# EAGLE design wfipic32 (EAGLE 9.6.2)
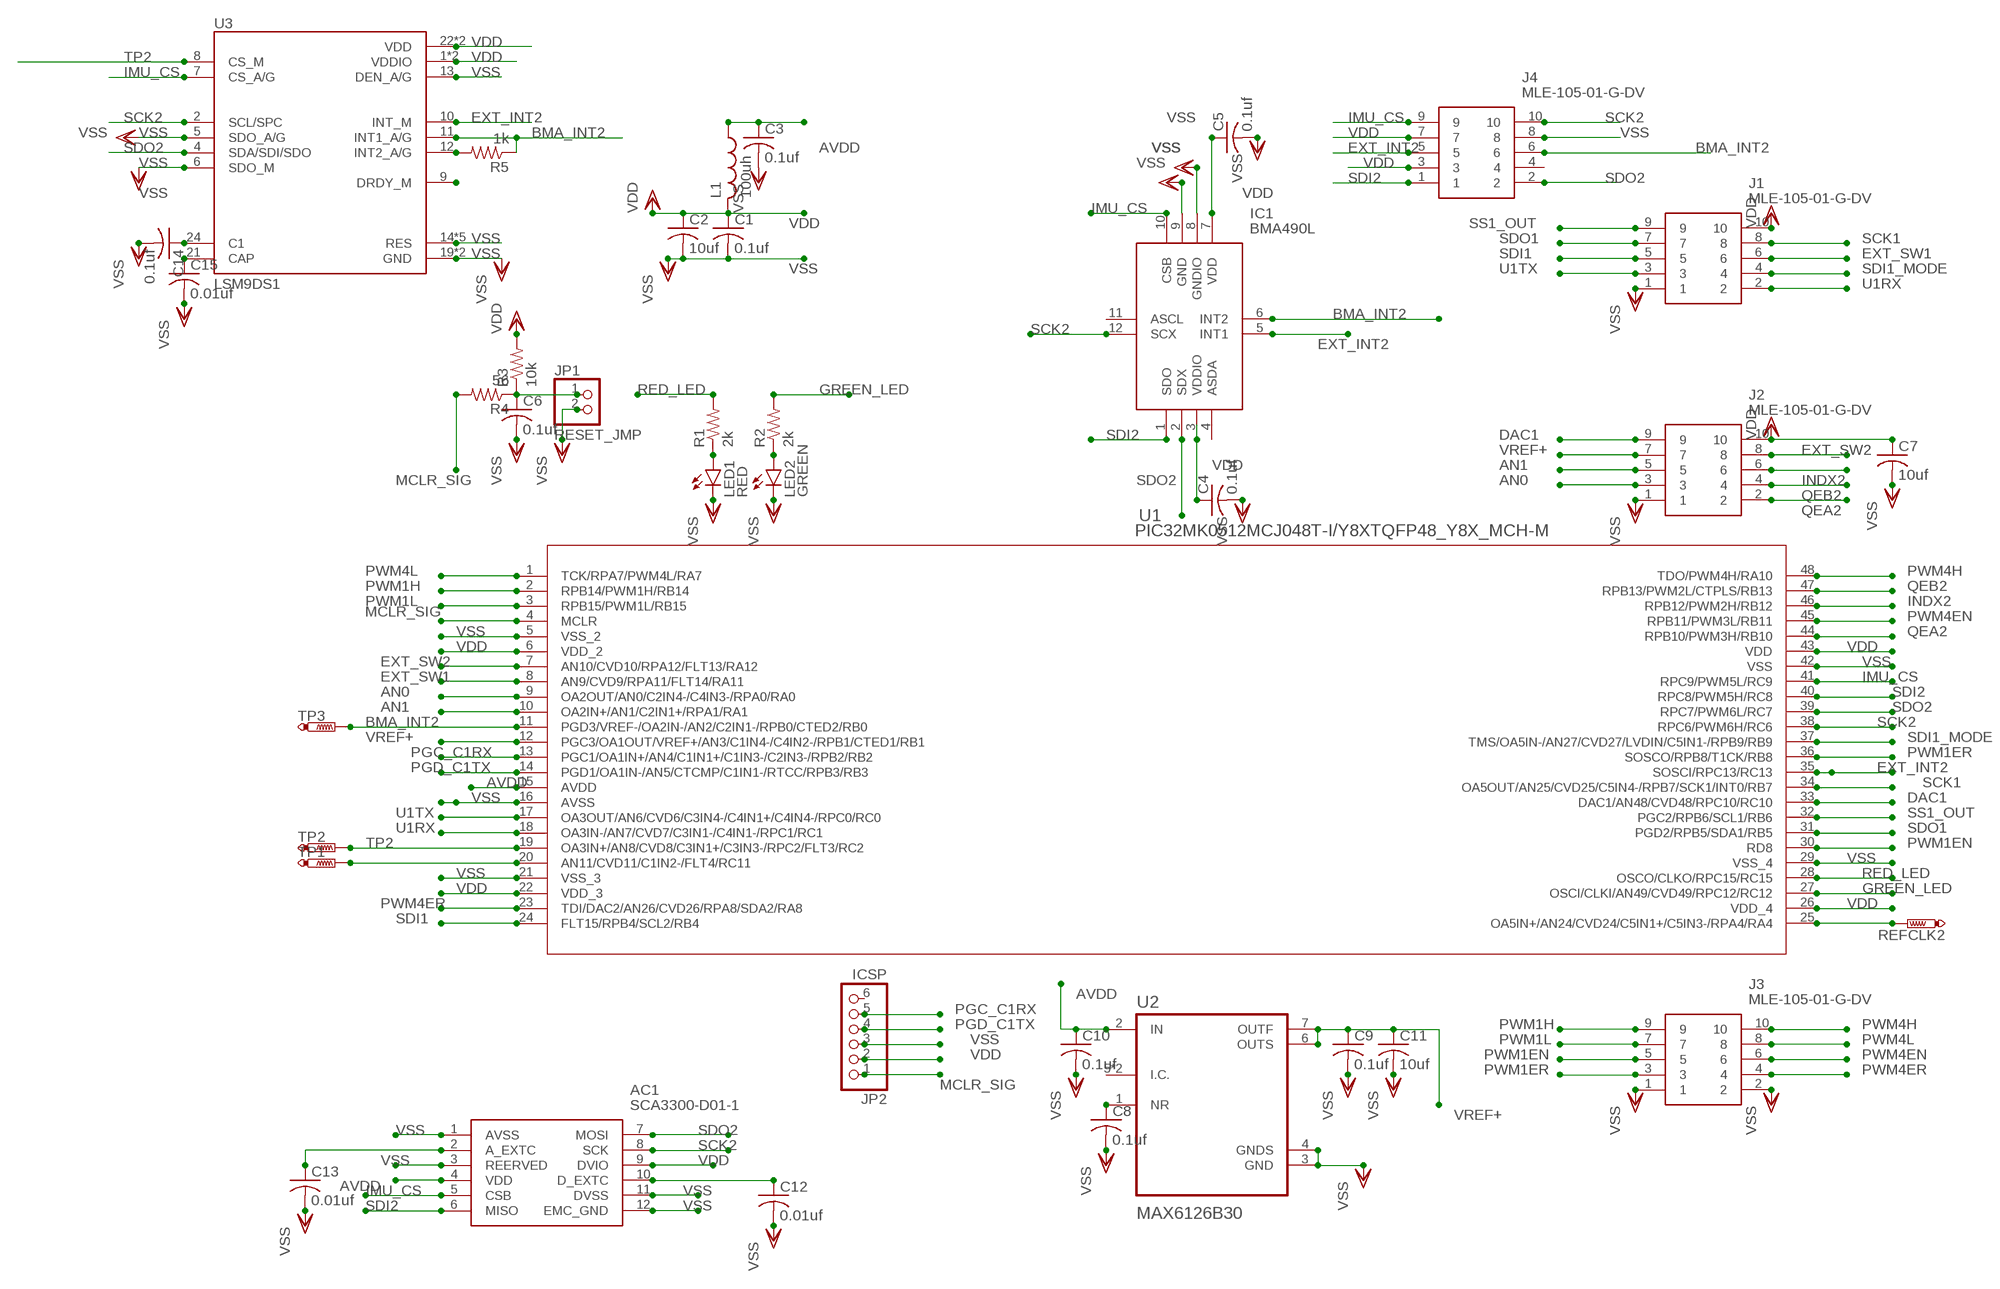
[diagram p0: schematic, sheet 1]

## Parts
AC1  SCA3300-D01-1  [SCA3300]
C1  0.1uf  C-USC0805  [C0805]
C2  10uf  C-USC0805  [C0805]
C3  0.1uf  C-USC0805  [C0805]
C4  0.1uf  C-USC0805  [C0805]
C5  0.1uf  C-USC0805  [C0805]
C6  0.1uf  C-USC0805  [C0805]
C7  10uf  C-USC0805  [C0805]
C8  0.1uf  C-USC0805  [C0805]
C9  0.1uf  C-USC0805  [C0805]
C10  0.1uf  C-USC0805  [C0805]
C11  10uf  C-USC0805  [C0805]
C12  0.01uf  C-USC0805  [C0805]
C13  0.01uf  C-USC0805  [C0805]
C14  0.1uf  C-USC0805  [C0805]
C15  0.01uf  C-USC0805  [C0805]
IC1  BMA490L  [BMA490L]
J1  MLE-105-01-G-DV  [MLE-105-01-G-DV]
J2  MLE-105-01-G-DV  [MLE-105-01-G-DV]
J3  MLE-105-01-G-DV  [MLE-105-01-G-DV]
J4  MLE-105-01-G-DV  [MLE-105-01-G-DV]
JP1  RESET_JMP  PINHD-1X2  [1X02]
JP2  ICSP  PINHD-1X6  [1X06]
L1  100uh  L-USL3216C  [L3216C]
LED1  RED  LEDCHIPLED_0603  [CHIPLED_0603]
LED2  GREEN  LEDCHIPLED_0603  [CHIPLED_0603]
R1  2k  R-US_M0805  [M0805]
R2  2k  R-US_M0805  [M0805]
R3  10k  R-US_M0805  [M0805]
R4  56  R-US_M0805  [M0805]
R5  1k  R-US_M0805  [M0805]
REFCLK2  PTR1PAD1-13  [P1-13]
TP1  PTR1PAD1-13  [P1-13]
TP2  PTR1PAD1-13  [P1-13]
TP3  PTR1PAD1-13  [P1-13]
U1  PIC32MK0512MCJ048T-I/Y8XTQFP48_Y8X_MCH-M  [TQFP48_Y8X_MCH-M]
U2  MAX6126B30  [SOP65P490X110-8N]
U3  LSM9DS1  [PQFN24P43_350X300X102L35X23N]

## Nets
AN0: J2.3 U1.9(OA2OUT/AN0/C2IN4-/C4IN3-/RPA0/RA0)
AN1: J2.5 U1.10(OA2IN+/AN1/C2IN1+/RPA1/RA1)
AVDD: AC1.4(VDD) C3.1 C10.1 L1.1 U1.15(AVDD) U2.2(IN)
BMA_INT2: IC1.6(INT2) J4.6 R5.1 TP3.TP U1.11(PGD3/VREF-/OA2IN-/AN2/C2IN1-/RPB0/CTED2/RB0) U3.11(INT1_A/G)
DAC1: J2.9 U1.33(DAC1/AN48/CVD48/RPC10/RC10)
EXT_INT2: IC1.5(INT1) J4.5 U1.35(SOSCI/RPC13/RC13) U3.10(INT_M)
EXT_SW1: J1.6 U1.8(AN9/CVD9/RPA11/FLT14/RA11)
EXT_SW2: J2.8 U1.7(AN10/CVD10/RPA12/FLT13/RA12)
GREEN_LED: R2.2 U1.27(OSCI/CLKI/AN49/CVD49/RPC12/RC12)
IMU_CS: AC1.5(CSB) IC1.10(CSB) J4.9 U1.41(RPC9/PWM5L/RC9) U3.7(CS_A/G)
INDX2: J2.6 U1.46(RPB12/PWM2H/RB12)
MCLR_SIG: JP2.1 R4.2 U1.4(MCLR)
N$1: LED1.A R1.1
N$2: LED2.A R2.1
N$3: C6.1 JP1.1 R3.1 R4.1
N$4: C8.1 U2.1(NR)
N$5: TP1.TP U1.20(AN11/CVD11/C1IN2-/FLT4/RC11)
N$7: AC1.10(D_EXTC) C12.1
N$8: REFCLK2.TP U1.25(OA5IN+/AN24/CVD24/C5IN1+/C5IN3-/RPA4/RA4)
N$9: AC1.2(A_EXTC) C13.1
N$10: C14.1 U3.24(C1)
N$11: C15.1 U3.21(CAP)
N$12: R5.2 U3.12(INT2_A/G)
N$13: U3.9(DRDY_M)
PGC_C1RX: JP2.5 U1.13(PGC1/OA1IN+/AN4/C1IN1+/C1IN3-/C2IN3-/RPB2/RB2)
PGD_C1TX: JP2.4 U1.14(PGD1/OA1IN-/AN5/CTCMP/C1IN1-/RTCC/RPB3/RB3)
PWM1EN: J3.5 U1.30(RD8)
PWM1ER: J3.3 U1.36(SOSCO/RPB8/T1CK/RB8)
PWM1H: J3.9 U1.2(RPB14/PWM1H/RB14)
PWM1L: J3.7 U1.3(RPB15/PWM1L/RB15)
PWM4EN: J3.6 U1.45(RPB11/PWM3L/RB11)
PWM4ER: J3.4 U1.23(TDI/DAC2/AN26/CVD26/RPA8/SDA2/RA8)
PWM4H: J3.10 U1.48(TDO/PWM4H/RA10)
PWM4L: J3.8 U1.1(TCK/RPA7/PWM4L/RA7)
QEA2: J2.2 U1.44(RPB10/PWM3H/RB10)
QEB2: J2.4 U1.47(RPB13/PWM2L/CTPLS/RB13)
RED_LED: R1.2 U1.28(OSCO/CLKO/RPC15/RC15)
SCK1: J1.8 U1.34(OA5OUT/AN25/CVD25/C5IN4-/RPB7/SCK1/INT0/RB7)
SCK2: AC1.8(SCK) IC1.12(SCX) J4.10 U1.38(RPC6/PWM6H/RC6) U3.2(SCL/SPC)
SDI1: J1.5 U1.24(FLT15/RPB4/SCL2/RB4)
SDI1_MODE: J1.4 U1.37(TMS/OA5IN-/AN27/CVD27/LVDIN/C5IN1-/RPB9/RB9)
SDI2: AC1.6(MISO) IC1.1(SDO) J4.1 U1.40(RPC8/PWM5H/RC8)
SDO1: J1.7 U1.31(PGD2/RPB5/SDA1/RB5)
SDO2: AC1.7(MOSI) IC1.2(SDX) J4.2 U1.39(RPC7/PWM6L/RC7) U3.4(SDA/SDI/SDO)
SS1_OUT: J1.9 U1.32(PGC2/RPB6/SCL1/RB6)
TP2: TP2.TP U1.19(OA3IN+/AN8/CVD8/C3IN1+/C3IN3-/RPC2/FLT3/RC2) U3.8(CS_M)
U1RX: J1.2 U1.18(OA3IN-/AN7/CVD7/C3IN1-/C4IN1-/RPC1/RC1)
U1TX: J1.3 U1.17(OA3OUT/AN6/CVD6/C3IN4-/C4IN1+/C4IN4-/RPC0/RC0)
VDD: AC1.9(DVIO) C1.1 C2.1 C4.1 C5.1 C7.1 IC1.3(VDDIO) IC1.7(VDD) J1.10 J2.10 J4.3 J4.7 JP2.2 L1.2 R3.2 U1.6(VDD_2) U1.22(VDD_3) U1.26(VDD_4) U1.43(VDD) U3.1(VDDIO) U3.3(VDDIO) U3.22(VDD) U3.23(VDD)
VREF+: C9.1 C11.1 J2.7 U1.12(PGC3/OA1OUT/VREF+/AN3/C1IN4-/C4IN2-/RPB1/CTED1/RB1) U2.6(OUTS) U2.7(OUTF)
VSS: AC1.1(AVSS) AC1.3(REERVED) AC1.11(DVSS) AC1.12(EMC_GND) C1.2 C2.2 C3.2 C4.2 C5.2 C6.2 C7.2 C8.2 C9.2 C10.2 C11.2 C12.2 C13.2 C14.2 C15.2 IC1.8(GNDIO) IC1.9(GND) J1.1 J2.1 J3.1 J3.2 J4.8 JP1.2 JP2.3 LED1.C LED2.C U1.5(VSS_2) U1.16(AVSS) U1.21(VSS_3) U1.29(VSS_4) U1.42(VSS) U2.3(GND) U2.4(GNDS) U3.5(SDO_A/G) U3.6(SDO_M) U3.13(DEN_A/G) U3.14(RES) U3.15(RES) U3.16(RES) U3.17(RES) U3.18(RES) U3.19(GND) U3.20(GND)
Unconnected: IC1.4(ASDA) IC1.11(ASCL) J4.4 JP2.6 U2.5(I.C.) U2.8(I.C.)

## Library data of the parts
AC1 = SCA3300-D01-1:SCA3300-D01-1: Murata SCA3300-D01-1, 3-Axis Accelerometer, +/-1.5 +/-6g, 3 3.6 V, SPI, DFL/SMD 12-Pin Source: Datasheet <https://www.murata.com/~/media/webrenewal/products/sensor/accel/sca3300/sca3300-d01 industrial 3-axis accelerometer datasheet _a1.ashx> Check availability <https://pricing.snapeda.com/parts/SCA3300-D01-1/Murata%20Electronics/view-part?ref=eda>; AVAILABILITY: In Stock; DESCRIPTION: Accelerometer X, Y, Z Axis ±1.5g, 3g, 6g - -; MF: Murata Electronics; MP: SCA3300-D01-1; PACKAGE: Nonstandard Murata; PRICE: None; PURCHASE-URL: https://pricing.snapeda.com/search/part/SCA3300-D01-1/?ref=eda
C1-C15 = rcl:C-US: CAPACITOR, American symbol; SPICEPREFIX: C
IC1 = SamacSys_Parts:BMA490L: Accelerometers High-performance longevity acceleration sensor Source: Datasheet <https://www.mouser.es/datasheet/2/783/bst-bma490l-ds000-1878796.pdf>; DESCRIPTION: Accelerometers High-performance longevity acceleration sensor; HEIGHT: 1mm; MANUFACTURER_NAME: Bosch Sensortec; MANUFACTURER_PART_NUMBER: BMA490L; MOUSER_PART_NUMBER: 262-BMA490L; MOUSER_PRICE-STOCK: https://www.mouser.co.uk/ProductDetail/Bosch-Sensortec/BMA490L?qs=7MVldsJ5UawjTpioRTbJPQ%3D%3D
J1-J4 = MLE-105-01-G-DV:MLE-105-01-G-DV: 10 Position, 1.00 mm Tiger Beam™ Cost-Effective Single Beam Socket Strip Source: Datasheet <http://suddendocs.samtec.com/prints/mle-1xx-xx-x-dv-x-mkt1.pdf>; DESCRIPTION: 10 Position, 1.00 mm Tiger Beam&trade; Cost-Effective Single Beam Socket Strip; HEIGHT: mm; MANUFACTURER_NAME: SAMTEC; MANUFACTURER_PART_NUMBER: MLE-105-01-G-DV; MOUSER_PART_NUMBER: 200-MLE10501GDV; MOUSER_PRICE-STOCK: https://www.mouser.co.uk/ProductDetail/Samtec/MLE-105-01-G-DV?qs=rU5fayqh%252BE2dXiDvl4XeQQ%3D%3D
JP1 = pinhead:PINHD-1X2: PIN HEADER
JP2 = pinhead:PINHD-1X6: PIN HEADER
L1 = rcl:L-US: INDUCTOR, American symbol; SPICEPREFIX: L
LED1 LED2 = led:LED: LED OSRAM: - CHIPLED LG R971, LG N971, LY N971, LG Q971, LY Q971, LO R971, LY R971 LH N974, LH R974 LS Q976, LO Q976, LY Q976 LO Q996 - Hyper CHIPLED LW Q18S LB Q993, LB Q99A, LB R99A - SideLED LS A670, LO A670, LY A670, LG A670, LP A670 LB A673, LV A673, LT A673, LW A673 LH A674 LY A675 LS A676, LA A676, LO A676, LY A676, LW A676 LS A679, LY A679, LG A679 - Hyper Micro SIDELED® LS Y876, LA Y876, LO Y876, LY Y876 LT Y87S - SmartLED LW L88C, LW L88S LB L89C, LB L89S, LG L890 LS L89K, LO L89K, LY L89K LS L896, LA L896, LO L896, LY L896 - TOPLED LS T670, LO T670, LY T670, LG T670, LP T670 LSG T670, LSP T670, LSY T670, LOP T670, LYG T670 LG T671, LOG T671, LSG T671 LB T673, LV T673, LT T673, LW T673 LH T674 LS T676, LA T676, LO T676, LY T676, LB T676, LH T676, LSB T676, LW T676 LB T67C, LV T67C, LT T67C, LS T67K, LO T67K, LY T67K, LW E67C LS E67B, LA E67B, LO E67B, LY E67B, LB E67C, LV E67C, LT E67C LW T67C LS T679, LY T679, LG T679 LS T770, LO T770, LY T770, LG T770, LP T770 LB T773, LV T773, LT T773, LW T773 LH T774 LS E675, LA E675, LY E675, LS T675 LS T776, LA T776, LO T776, LY T776, LB T776 LHGB T686 LT T68C, LB T68C - Hyper Mini TOPLED® LB M676 - Mini TOPLED Santana® LG M470 LS M47K, LO M47K, LY M47K Source: http://www.osram.convergy.de LUXEON: - LUMILED® LXK2-PW12-R00, LXK2-PW12-S00, LXK2-PW14-U00, LXK2-PW14-V00 LXK2-PM12-R00, LXK2-PM12-S00, LXK2-PM14-U00 LXK2-PE12-Q00, LXK2-PE12-R00, LXK2-PE12-S00, LXK2-PE14-T00, LXK2-PE14-U00 LXK2-PB12-K00, LXK2-PB12-L00, LXK2-PB12-M00, LXK2-PB14-N00, LXK2-PB14-P00, LXK2-PB14-Q00 LXK2-PR12-L00, LXK2-PR12-M00, LXK2-PR14-Q00, LXK2-PR14-R00 LXK2-PD12-Q00, LXK2-PD12-R00, LXK2-PD12-S00 LXK2-PH12-R00, LXK2-PH12-S00 LXK2-PL12-P00, LXK2-PL12-Q00, LXK2-PL12-R00 Source: www.luxeon.com KINGBRIGHT: KA-3528ASYC Source: www.kingbright.com
R1-R5 = rcl:R-US_: RESISTOR, American symbol; SPICEPREFIX: R
REFCLK2 TP1-TP3 = testpad:PTR1: TEST PIN
U1 = 2022-08-07_22-50-41_Library:PIC32MK0512MCJ048T-I/Y8X; COPYRIGHT: Copyright (C) 2022 Ultra Librarian. All rights reserved.; MANUFACTURER_PART_NUMBER: PIC32MK0512MCJ048T-I/Y8X; MFR_NAME: Microchip
U2 = MAX6126B30:MAX6126B30; DESCRIPTION: Series Voltage Reference IC Fixed 3V V ±0.1% 10 mA 8-uMAX-EP|8-uSOP-EP; DIGI-KEY_PART_NUMBER: MAX6126B30+T-ND; MF: Maxim Integrated; MP: MAX6126B30+T; PACKAGE: MICRO MAX-8 Maxim; PURCHASE-URL: https://pricing.snapeda.com/search/part/MAX6126B30+T/?ref=eda
U3 = LSM9DS1:LSM9DS1: iNEMO inertial module: 3D accelerometer, 3D gyroscope, 3D magnetometer; AVAILABILITY: Unavailable; DESCRIPTION: Accelerometer, Gyroscope, Magnetometer, Temperature, 9 Axis Sensor I²C, SPI Output; MF: STMicroelectronics; MP: LSM9DS1; PACKAGE: TFLGA-24 STMicroelectronics; PRICE: None

## Board
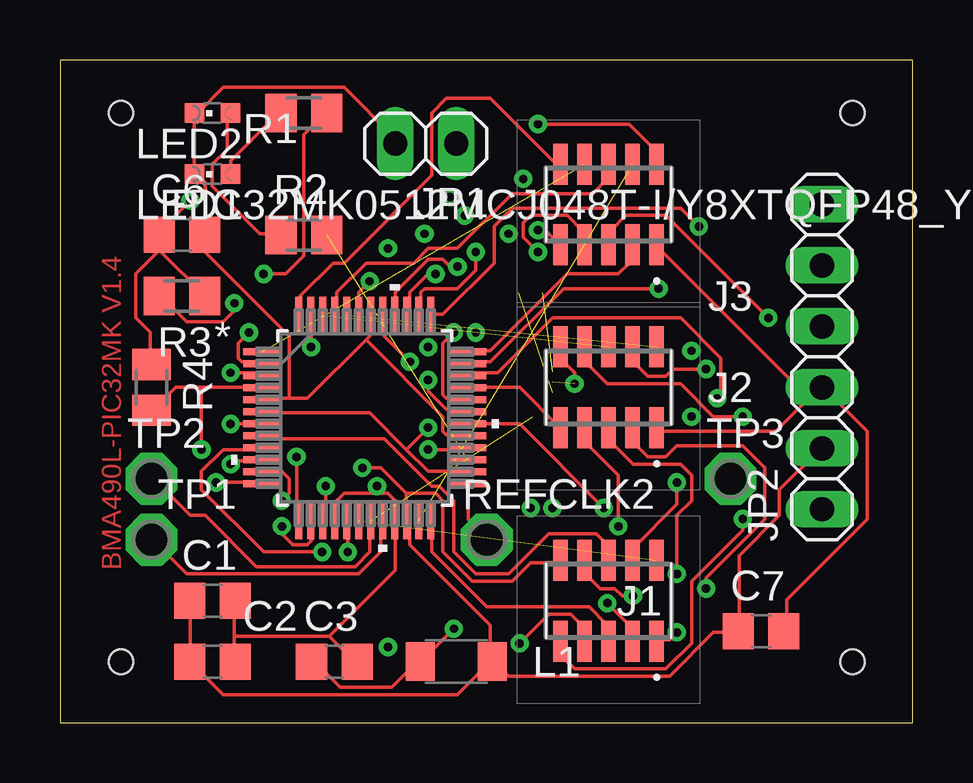
[diagram p1: board, top side]
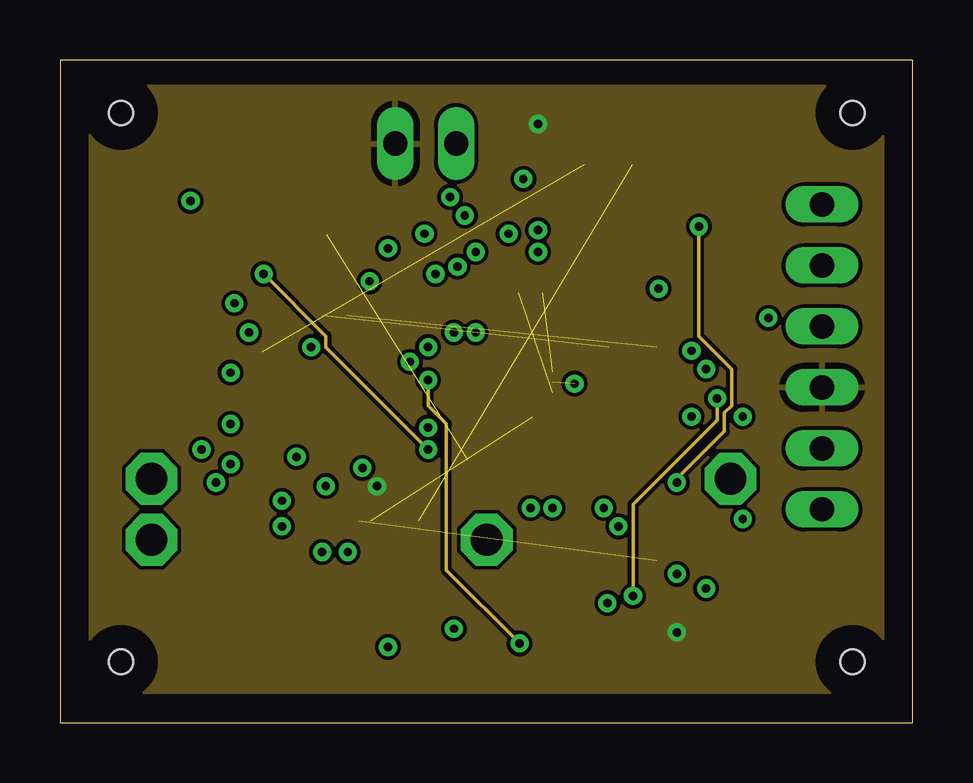
[diagram p2: board, inner layer Route2]
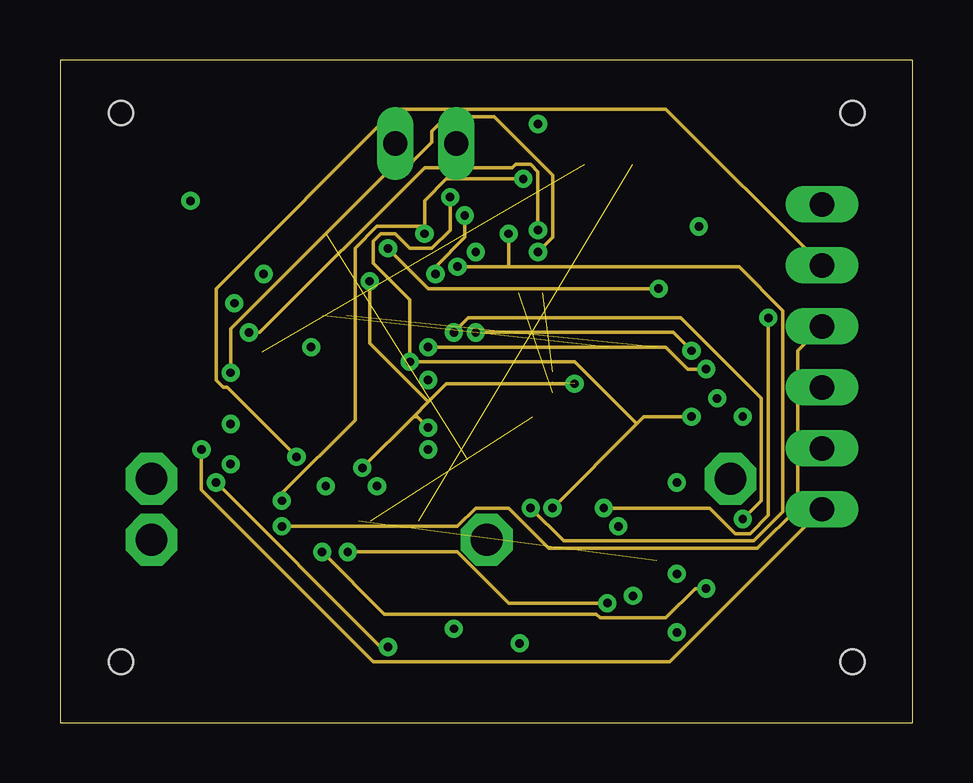
[diagram p3: board, inner layer Route15]
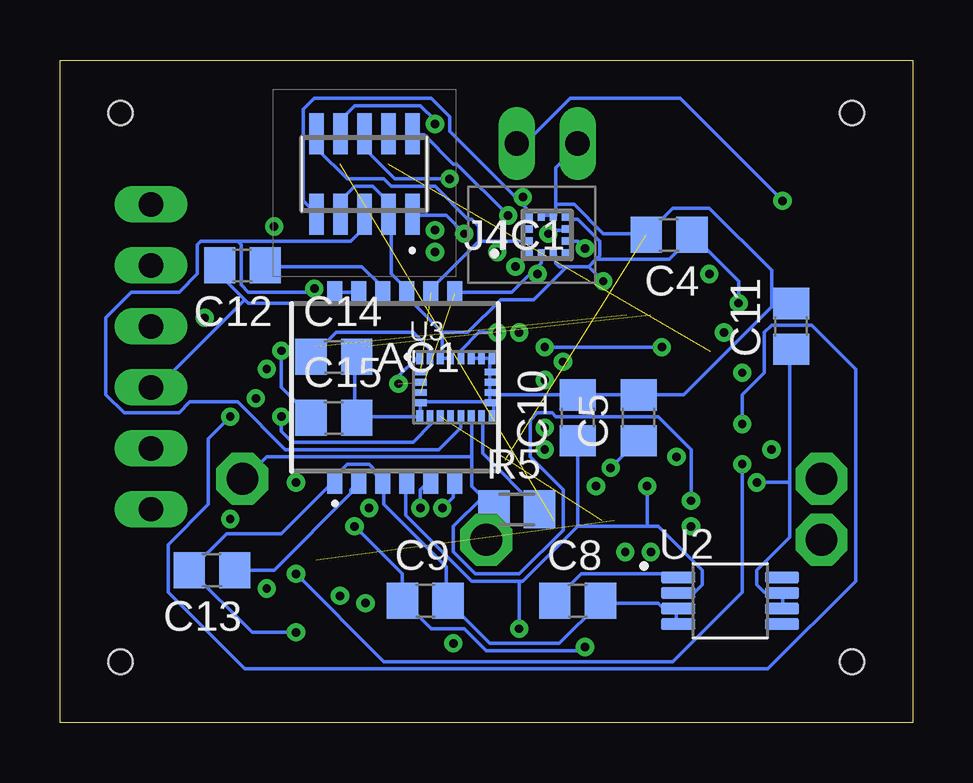
[diagram p4: board, bottom side, seen from below]

Size 35.54 x 27.61 mm. Coordinates in mm from the lower left corner, seen from the top.
Outline: 0,0 35.54,0 35.54,27.61 0,27.61 0,0
Copper layers (1+2*15+16): Top 0.035mm / dielectric 1.5mm / Route2 0.035mm / dielectric 0.15mm / Route15 0.035mm / dielectric 0.2mm / Bottom 0.035mm
Design rules "default *": minimum track width 6mil, minimum drill 0.35mm, track to track 6mil, track to pad 6mil, pad to pad 6mil, via to via 6mil, smd to smd 6mil, copper to edge 40mil, drill to drill 6mil, minimum pad ring 10mil, minimum via ring 8mil, stop-mask expansion 4mil, vias tented up to drill 0mil, thermal gap 10mil
Holes 1.02 mm at 2.54,2.54 2.54,25.4 33.02,25.4 33.02,2.54

### Footprints (pad centres in the part's own frame; a part is rotated, then mirrored left to right if it is on the bottom)
SCA3300 = smd 0.61 x 0.98: 1 -2.5,-3.935; 2 -1.5,-3.935; 3 -0.5,-3.935; 4 0.5,-3.935; 5 1.5,-3.935; 6 2.5,-3.935; 7 2.5,3.935; 8 1.5,3.935; 9 0.5,3.935; 10 -0.5,3.935; 11 -1.5,3.935; 12 -2.5,3.935
C0805 = smd 1.3 x 1.5: 1 -0.95,0; 2 0.95,0
BMA490L = smd 0.3 x 0.35: 1 -0.75,-0.775; 2 -0.25,-0.775; 3 0.25,-0.775; 4 0.75,-0.775; 7 0.75,0.775; 8 0.25,0.775; 9 -0.25,0.775; 10 -0.75,0.775 | smd 0.35 x 0.3: 5 0.775,-0.25; 6 0.775,0.25; 11 -0.775,0.25; 12 -0.775,-0.25
MLE-105-01-G-DV = smd 0.61 x 1.709: 1 2,-1.685; 2 2,1.685; 3 1,-1.685; 4 1,1.685; 5 0,-1.685; 6 0,1.685; 7 -1,-1.685; 8 -1,1.685; 9 -2,-1.685; 10 -2,1.685
1X02 = drill 1.016 long: 1 -1.27,0; 2 1.27,0
1X06 = drill 1.016 long: 1 -6.35,0; 2 -3.81,0; 3 -1.27,0; 4 1.27,0; 5 3.81,0; 6 6.35,0
L3216C = smd 1.2 x 1.6: 1 -1.5,0; 2 1.5,0
CHIPLED_0603 = smd 0.8 x 0.8: A 0,-0.75; C 0,0.75
M0805 = smd 1.3 x 1.6: 1 -0.95,0; 2 0.95,0
P1-13 = drill 1.321 pad 2.159 octagon: TP 0,0
TQFP48_Y8X_MCH-M = smd 1.549 x 0.279: 1 -4.28,2.75; 2 -4.28,2.25; 3 -4.28,1.75; 4 -4.28,1.25; 5 -4.28,0.75; 6 -4.28,0.25; 7 -4.28,-0.25; 8 -4.28,-0.75; 9 -4.28,-1.25; 10 -4.28,-1.75; 11 -4.28,-2.25; 12 -4.28,-2.75; 25 4.28,-2.75; 26 4.28,-2.25; 27 4.28,-1.75; 28 4.28,-1.25; 29 4.28,-0.75; 30 4.28,-0.25; 31 4.28,0.25; 32 4.28,0.75; 33 4.28,1.25; 34 4.28,1.75; 35 4.28,2.25; 36 4.28,2.75 | smd 0.279 x 1.549: 13 -2.75,-4.28; 14 -2.25,-4.28; 15 -1.75,-4.28; 16 -1.25,-4.28; 17 -0.75,-4.28; 18 -0.25,-4.28; 19 0.25,-4.28; 20 0.75,-4.28; 21 1.25,-4.28; 22 1.75,-4.28; 23 2.25,-4.28; 24 2.75,-4.28; 37 2.75,4.28; 38 2.25,4.28; 39 1.75,4.28; 40 1.25,4.28; 41 0.75,4.28; 42 0.25,4.28; 43 -0.25,4.28; 44 -0.75,4.28; 45 -1.25,4.28; 46 -1.75,4.28; 47 -2.25,4.28; 48 -2.75,4.28
SOP65P490X110-8N = smd 1.42 x 0.47: 1 -2.165,0.975; 2 -2.165,0.325; 3 -2.165,-0.325; 4 -2.165,-0.975; 5 2.165,-0.975; 6 2.165,-0.325; 7 2.165,0.325; 8 2.165,0.975
PQFN24P43_350X300X102L35X23N = smd 0.28 x 0.53: 1 -1.505,1.225; 6 -1.505,-1.225; 7 -1.075,-1.225; 8 -0.645,-1.225; 9 -0.215,-1.225; 10 0.215,-1.225; 11 0.645,-1.225; 12 1.075,-1.225; 13 1.505,-1.225; 18 1.505,1.225; 19 1.075,1.225; 20 0.645,1.225; 21 0.215,1.225; 22 -0.215,1.225; 23 -0.645,1.225; 24 -1.075,1.225 | smd 0.53 x 0.28: 2 -1.47,0.645; 3 -1.47,0.215; 4 -1.47,-0.215; 5 -1.47,-0.645; 14 1.47,-0.645; 15 1.47,-0.215; 16 1.47,0.215; 17 1.47,0.645

### Placement (x,y rotation side)
AC1  21.59,13.97 0 bottom
C1  6.35,5.08 0 top
C2  6.35,2.54 0 top
C3  11.43,2.54 0 top
C4  10.16,20.32 180 bottom
C5  11.43,12.7 90 bottom
C6  5.08,20.32 0 top
C7  29.21,3.81 0 top
C8  13.97,5.08 0 bottom
C9  20.32,5.08 0 bottom
C10  13.97,12.7 90 bottom
C11  5.08,16.51 90 bottom
C12  27.94,19.05 180 bottom
C13  29.21,6.35 180 bottom
C14  24.13,15.24 0 bottom
C15  24.13,12.7 0 bottom
IC1  15.24,20.32 0 bottom
J1  22.86,5.08 0 top
J2  22.86,13.97 0 top
J3  22.86,21.59 0 top
J4  22.86,22.86 0 bottom
JP1  15.24,24.13 180 top
JP2  31.75,15.24 90 top
L1  16.51,2.54 0 top
LED1  6.35,22.86 90 top
LED2  6.35,25.4 90 top
R1  10.16,25.4 0 top
R2  10.16,20.32 0 top
R3  5.08,17.78 180 top
R4  3.81,13.97 270 top
R5  16.51,8.89 0 bottom
REFCLK2  17.78,7.62 0 top
TP1  3.81,7.62 0 top
TP2  3.81,10.16 0 top
TP3  27.94,10.16 0 top
U1  12.7,12.7 0 top
U2  7.62,5.08 0 bottom
U3  19.05,13.97 0 bottom

### Tracks (layer width: path | path; a pad name or v marks a point on that pad's centre or on a via)
AN0  (via drill 0.35)
  Top 0.152: v10.92,7.11 8.48,7.11 5.89,9.7 5.89,10.46 6.81,11.38 8.33,11.38 U1.9 | v26.92,5.59 26.92,6.04 29.36,8.48 29.36,10.62 28.45,11.53 25.7,11.53 25.25,11.07 24.49,11.07 23.88,11.68 23.88,12.14 J2.3
  Route15 0.152: v10.92,7.11 13.51,4.52 22.35,4.52 22.5,4.37 25.25,4.37 26.47,5.59 v26.92,5.59
AN1  (via drill 0.35)
  Top 0.152: v7.11,10.77 7.26,10.92 8.33,10.92 U1.10 | v25.7,6.2 25.7,8.64 26.31,9.25 26.31,10.31 25.86,10.77 23.88,10.77 22.96,11.68 22.96,12.14 J2.5
  Bottom 0.152: v7.11,10.77 7.11,5.44 10.01,2.54 22.05,2.54 v25.7,6.2
AVDD  (via drill 0.35)
  Top 0.152: C3.1 10.62,2.54 11.68,1.47 13.82,1.47 14.88,2.54 L1.1 15.04,2.54 v16.41,3.91 | v11.07,9.86 11.07,8.48 U1.15
  Bottom 0.152: 16.41,5.89 16.26,5.89 13.97,8.18 | 16.41,5.89 18.39,5.89 21.13,8.64 21.13,10.01 AC1.4 | C10.1 13.97,8.18 | 13.97,8.18 11.07,8.18 | 11.07,8.18 10.62,8.18 8.79,6.35 8.79,5.74 9.09,5.44 9.7,5.44 U2.2 | 11.07,8.18 v11.07,9.86 | 16.41,5.89 v16.41,3.91
BMA_INT2  (via drill 0.35)
  Top 0.152: v9.25,9.25 9.55,9.55 9.55,10.16 9.25,10.46 8.48,10.46 U1.11
  Route15 0.152: 15.19,20.68 15.19,21.74 16.1,22.66 v19.3,22.66 | v9.25,9.25 9.25,9.55 12.29,12.6 12.29,19.76 13.21,20.68 15.19,20.68 | 15.19,20.68 v15.19,20.37
  Bottom 0.152: 18.39,11.07 18.39,9.86 17.93,9.4 | 18.39,11.07 18.39,12.6 U3.11 | 17.93,9.4 17.48,8.94 R5.1 17.93,9.4 | 18.39,11.07 26.92,11.07 27.84,10.16 TP3.TP | v15.19,20.37 15.04,20.52 14.58,20.52 IC1.6 | v19.3,22.66 21.59,22.66 22.81,23.88 22.81,24.49 J4.6 | 17.93,9.4 19.15,8.18 19.15,7.11 18.24,6.2 16.41,6.2 14.58,8.03 14.58,9.7 15.95,11.07 15.95,12.6 15.65,12.9 15.04,12.9 14.88,12.75 10.62,12.75 9.25,11.38 v9.25,9.25
DAC1
  Top 0.152: U1.33 17.02,13.97 19.15,13.97 20.83,12.29 J2.9
EXT_INT2  (via drill 0.35)
  Top 0.152: v24.94,18.08 20.98,18.08 17.93,15.04 17.02,15.04 U1.35
  Route15 0.152: v13.66,19.76 15.34,18.08 v24.94,18.08
  Bottom 0.152: v13.66,19.76 13.97,20.07 14.43,20.07 IC1.5 | 28.14,20.07 29.67,20.07 29.82,19.91 29.82,18.69 30.58,17.93 32.56,17.93 33.63,16.87 33.63,13.66 32.87,12.9 30.58,12.9 30.12,13.36 28.14,13.36 26.16,11.38 19.76,11.38 18.85,12.29 18.85,12.6 U3.10 | 28.14,20.07 27.99,19.91 27.99,18.24 27.69,17.93 25.09,17.93 v24.94,18.08 | 28.14,20.07 23.42,20.07 22.96,20.52 22.96,21.13 J4.5
EXT_SW1
  Top 0.152: U1.8 8.48,11.84 13.51,11.84 15.49,9.86 15.8,9.86 16.41,9.25 16.41,7.11 17.32,6.2 18.69,6.2 20.37,7.87 22.35,7.87 22.81,7.42 22.81,6.81 J1.6
EXT_SW2  (via drill 0.35)
  Top 0.152: v7.11,12.45 8.33,12.45 U1.7 | v28.45,12.75 27.23,12.75 25.86,14.12 22.81,14.12 21.89,15.04 21.89,15.65 J2.8
  Bottom 0.152: v7.11,12.45 7.11,13.66 6.2,14.58 6.2,16.26 5.89,16.56 4.22,16.56 2.39,14.73 2.39,5.89 6.04,2.23 27.84,2.23 31.04,5.44 31.04,7.42 29.36,9.09 29.36,11.84 v28.45,12.75
GREEN_LED  (1 unrouted)
IMU_CS  (via drill 0.35)
  Top 0.152: v14.58,15.04 13.51,16.1 13.51,16.87 U1.41
  Route15 0.152: v26.31,12.75 24.33,12.75 24.03,12.45 | v20.52,8.94 24.03,12.45 | 24.03,12.45 21.44,15.04 v14.58,15.04 14.58,17.63 13.06,19.15 13.06,20.07 13.36,20.37 13.97,20.37 14.58,19.76 15.49,19.76 16.26,20.52 v16.26,21.89
  Bottom 0.152: 16.41,21.74 19.3,24.64 19.3,25.25 20.07,26.01 24.94,26.01 25.4,25.55 25.4,21.74 24.94,21.29 J4.9 | 16.41,21.74 16.1,21.44 16.1,21.13 IC1.10 | v26.31,12.75 26.31,12.14 25.86,11.68 20.83,11.68 20.07,12.45 20.07,12.6 U3.7 | v20.52,8.94 20.52,9.7 20.22,10.01 AC1.5 | v16.26,21.89 16.41,21.74
INDX2  (1 unrouted)
MCLR_SIG  (via drill 0.35)
  Top 0.152: 5.89,13.97 4.83,13.97 3.91,13.06 R4.2 | 5.89,13.97 8.33,13.97 U1.4 | 5.89,13.97 v5.89,11.38
  Route15 0.152: JP2.1 25.4,2.54 13.06,2.54 5.89,9.7 v5.89,11.38
N$1
  Top 0.152: LED1.A 7.11,22.96 7.11,23.42 9.09,25.4 R1.1
N$2
  Top 0.152: LED2.A 6.96,25.4 6.96,23.88 6.35,23.27 6.35,22.35 8.33,20.37 9.09,20.37 R2.1
N$3  (via drill 0.35)
  Top 0.152: 4.22,19.76 4.22,19.61 6.04,17.78 R3.1 | 4.22,19.76 4.22,20.22 C6.1 | 4.22,19.76 3.15,18.69 3.15,16.87 3.76,16.26 3.76,15.04 R4.1 | 4.22,19.76 C6.1 | v5.44,21.74 4.06,20.37 C6.1
  Bottom 0.152: v5.44,21.74 9.7,26.01 14.27,26.01 16.1,24.18 16.41,24.18 JP1.1
N$4
  Bottom 0.152: U2.1 9.86,6.2 13.82,6.2 14.88,5.13 C8.1
N$5
  Top 0.152: U1.20 13.36,8.33 13.36,7.11 12.45,6.2 5.28,6.2 3.91,7.57 TP1.TP
N$7
  Bottom 0.152: AC1.10 22.2,17.93 22.2,18.24 22.96,19 26.92,19 C12.1
N$8
  Top 0.152: U1.25 17.02,9.86 17.02,8.48 17.78,7.72 REFCLK2.TP
N$9
  Bottom 0.152: C13.1 26.62,6.35 23.42,9.55 23.42,9.7 23.11,10.01 AC1.2
N$10
  Bottom 0.152: U3.24 20.07,15.34 20.07,15.49 20.83,16.26 24.03,16.26 24.94,15.34 C14.1
N$11  (via drill 0.35)
  Route15 0.152: v17.32,16.26 25.55,16.26 v26.31,15.49
  Bottom 0.152: v17.32,16.26 18.09,16.26 18.85,15.49 18.85,15.34 U3.21 | v26.31,15.49 26.31,13.97 25.09,12.75 C15.1
N$12
  Bottom 0.152: U3.12 17.93,12.6 17.93,11.23 15.65,8.94 R5.2
PGC_C1RX  (via drill 0.35)
  Top 0.152: v9.86,11.07 9.86,8.48 U1.13
  Route15 0.152: v9.86,11.07 6.96,13.97 6.81,13.97 6.5,14.28 6.5,18.08 13.97,25.55 25.25,25.55 JP2.5
PGD_C1TX  (via drill 0.35)
  Top 0.152: v9.25,8.18 9.25,7.87 9.7,7.42 10.31,7.42 10.46,7.57 10.46,8.33 U1.14
  Route15 0.152: v9.25,8.18 16.56,8.18 17.32,8.94 18.69,8.94 20.37,7.26 29.06,7.26 30.73,8.94 30.73,15.49 JP2.4
PWM1EN  (via drill 0.35)
  Top 0.152: v22.66,8.94 19.15,12.45 17.02,12.45 U1.30 | v29.52,16.87 25.25,21.13 23.57,21.13 22.96,20.52 22.96,19.91 J3.5
  Route15 0.152: v22.66,8.94 27.08,8.94 28.14,7.87 28.75,7.87 29.52,8.64 v29.52,16.87
PWM1ER
  Top 0.152: U1.36 17.02,15.49 17.93,15.49 21.13,18.69 23.27,18.69 23.72,19.15 23.72,19.76 J3.3
PWM1H  (via drill 0.35)
  Top 0.152: v7.87,16.26 7.42,15.8 7.42,15.19 7.57,15.04 8.33,15.04 U1.2 | v19.91,20.52 20.22,20.52 20.83,19.91 J3.9
  Route15 0.152: v7.87,16.26 8.33,16.26 15.19,23.11 18.85,23.11 19,23.27 19.61,23.27 19.91,22.96 v19.91,20.52
PWM1L  (via drill 0.35)
  Top 0.152: v7.11,14.58 8.33,14.58 U1.3 | v19.91,19.61 19.3,20.22 19.3,20.83 19.61,21.13 21.13,21.13 21.74,20.52 21.74,19.91 J3.7
  Route15 0.152: v7.11,14.58 7.11,16.41 13.82,23.11 14.43,23.11 15.49,24.18 15.49,24.64 16.1,25.25 18.09,25.25 20.52,22.81 20.52,20.22 v19.91,19.61
PWM4EN
  Top 0.152: U1.45 11.53,17.02 11.53,17.93 12.75,19.15 14.73,19.15 15.34,19.76 16.56,19.76 18.85,22.05 22.2,22.05 22.81,22.66 22.81,23.27 J3.6
PWM4ER  (1 unrouted)
PWM4H
  Top 0.152: U1.48 10.01,17.02 10.01,17.78 11.38,19.15 11.84,19.15 15.49,22.81 15.49,25.4 16.1,26.01 17.93,26.01 20.52,23.42 20.83,23.42 J3.10
PWM4L  (1 unrouted)
QEA2  (1 unrouted)
QEB2  (via drill 0.35)
  Top 0.152: v10.46,15.65 10.46,16.87 U1.47 | v26.92,14.73 25.55,14.73 25.25,14.43 24.49,14.43 23.88,15.04 23.88,15.65 J2.4
  Route15 0.152: v15.34,15.65 25.25,15.65 26.16,14.73 v26.92,14.73
  Bottom 0.152: v15.34,15.65 v10.46,15.65
RED_LED  (via drill 0.35)
  Top 0.152: v15.34,11.38 16.87,11.38 U1.28 | v8.48,18.69 9.4,18.69 10.16,19.46 10.16,24.49 11.07,25.4 R1.2
  Route2 0.152: v15.34,11.38 11.07,15.65 11.07,16.1 v8.48,18.69
SCK1  (via drill 0.35)
  Top 0.152: v27.38,13.51 27.53,13.66 27.53,15.19 25.86,16.87 20.52,16.87 18.24,14.58 17.02,14.58 U1.34 | v23.88,5.28 23.42,5.28 23.11,5.59 22.5,5.59 21.89,6.2 21.89,6.65 J1.8
  Route2 0.152: v27.38,13.51 27.38,12.6 23.88,9.09 v23.88,5.28
SCK2  (via drill 0.35)  (1 unrouted)
  Top 0.152: v17.32,19.61 17.32,18.85 16.56,18.08 15.19,18.08 15.04,17.93 15.04,17.02 U1.38
  Bottom 0.152: 18.09,20.07 17.32,20.07 | 17.32,20.07 16.1,20.07 IC1.12 | 18.09,20.07 20.22,17.93 AC1.8 | 17.32,20.07 v17.32,19.61 | 18.09,20.07 18.09,20.68 18.39,20.98 18.54,20.98 19.91,22.35 21.74,22.35 22.05,22.66 23.57,22.66 24.79,23.88 24.79,24.49 J4.10
SDI1
  Top 0.152: U1.24 15.49,8.33 15.49,7.11 17.78,4.83 22.05,4.83 22.81,4.06 22.81,3.45 J1.5
SDI1_MODE  (via drill 0.35)
  Top 0.152: v26.62,20.68 25.86,21.44 18.85,21.44 18.09,20.68 18.09,19.15 15.95,17.02 15.49,17.02 U1.37 | v25.7,10.01 25.7,9.09 23.88,7.26 23.88,6.81 J1.4
  Route2 0.152: v26.62,20.68 26.62,16.1 27.99,14.73 27.99,13.21 27.69,12.9 27.69,12.14 25.7,10.16 v25.7,10.01
SDI2  (via drill 0.35)
  Top 0.152: v16.56,19 16.26,19 15.95,19.3 15.34,19.3 13.97,17.93 13.97,17.02 U1.40
  Route15 0.152: v19.61,8.94 20.98,7.57 28.9,7.57 30.12,8.79 30.12,17.17 28.3,19 18.69,19 | v16.56,19 18.69,19 | 18.69,19 v18.69,20.37
  Bottom 0.152: v16.56,19 16.1,19.46 IC1.1 | v19.61,8.94 19.15,9.4 19.15,10.01 AC1.6 | v18.69,20.37 19.46,21.13 20.83,21.13 J4.1
SDO1  (via drill 0.35)
  Top 0.152: v15.34,14.28 15.34,13.82 16.1,13.06 16.87,13.06 U1.31 | v19.15,3.3 20.37,4.52 21.29,4.52 21.74,4.06 21.74,3.45 J1.7
  Route2 0.152: v15.34,14.28 15.34,13.21 16.1,12.45 16.1,6.35 v19.15,3.3
SDO2  (via drill 0.35)  (1 unrouted)
  Top 0.152: v15.65,18.69 15.34,18.69 14.58,17.93 14.58,17.02 U1.39
  Route15 0.152: v16.87,21.13 16.87,20.22 15.65,19 v15.65,18.69
  Bottom 0.152: 15.8,18.85 16.71,17.93 19,17.93 AC1.7 | 15.8,18.85 15.49,19.15 15.49,19.46 IC1.2 | 15.8,18.85 v15.65,18.69 | v16.87,21.13 19,23.27 19.15,23.27 20.37,24.49 20.83,24.49 J4.2
SS1_OUT  (via drill 0.35)
  Top 0.152: v16.41,16.26 15.95,15.8 15.95,13.66 16.1,13.51 16.87,13.51 U1.32 | v28.45,8.48 28.45,8.03 26.31,5.89 26.31,3.3 25.25,2.23 21.44,2.23 20.98,2.69 20.98,3.3 J1.9
  Route15 0.152: v16.41,16.26 17.02,16.87 25.86,16.87 29.21,13.51 29.21,9.25 v28.45,8.48
TP2  (1 unrouted)
  Top 0.152: U1.19 12.9,8.33 12.9,7.11 12.29,6.5 8.18,6.5 6.04,8.64 5.44,8.64 3.91,10.16 TP2.TP
U1RX  (1 unrouted)
U1TX  (via drill 0.35)
  Top 0.152: v11.99,7.11 11.99,8.33 U1.17 | v22.81,4.98 23.72,4.06 23.72,3.45 J1.3
  Route15 0.152: v11.99,7.11 16.56,7.11 18.69,4.98 v22.81,4.98
VDD  (via drill 0.35)  (1 unrouted)
  Top 0.152: v12.9,18.39 12.45,17.93 12.45,17.02 U1.43 | v7.26,17.47 7.26,17.17 6.81,16.71 5.28,16.71 4.22,17.78 R3.2 | JP2.2 31.65,11.38 29.97,9.7 29.97,8.64 28.3,6.96 28.3,3.91 C7.1 28.14,3.76 27.23,3.76 25.4,1.93 18.69,1.93 18.09,2.54 L1.2 17.93,2.54 | 14.43,11.38 15.34,10.46 16.87,10.46 U1.26 | 14.43,11.38 12.9,12.9 8.48,12.9 U1.6 | 5.44,2.54 5.44,4.98 C1.1 | v21.44,14.12 21.44,14.58 20.98,15.04 20.98,15.65 J2.10 | v12.6,10.62 13.36,10.62 14.43,9.55 | 14.43,9.55 14.43,8.48 U1.22 14.58,8.33 14.58,7.42 17.93,4.06 17.93,2.54 | 14.43,9.55 15.65,9.55 15.95,9.25 15.95,7.11 17.17,5.89 18.85,5.89 19.61,6.65 20.83,6.65 J1.10 | 5.44,2.54 6.81,1.17 16.56,1.17 17.93,2.54 | 5.44,2.54 C2.1 | v15.34,12.29 14.43,11.38
  Route15 0.152: v21.44,14.12 16.1,14.12 15.34,13.36 | v12.6,10.62 14.73,12.75 | 14.73,12.75 15.34,13.36 | v15.34,12.29 14.88,12.75 14.73,12.75 | v12.9,18.39 12.9,15.8 15.34,13.36
  Bottom 0.152: U3.22 19.3,15.19 19.61,15.19 U3.23 19.61,15.34 19.61,16.26 | 19.61,16.26 21.13,17.78 AC1.9 20.98,17.93 21.74,18.69 21.74,21.13 J4.3 21.89,21.29 21.89,21.74 22.5,22.35 23.27,22.35 23.72,21.89 23.72,21.29 J4.7 | 13.51,19 13.21,19.3 | 13.21,19.3 13.06,19.46 13.06,20.07 13.97,20.98 14.43,20.98 IC1.7 | 14.43,19 14.73,19 14.88,19.15 14.88,19.46 IC1.3 | 14.43,19 13.51,19 | 13.21,19.3 10.16,19.3 9.25,20.22 C4.1 9.09,20.22 7.26,18.39 v7.26,17.47 | 13.51,19 v12.9,18.39 | 19.61,16.26 18.54,16.26 17.17,17.63 15.8,17.63 14.43,19 | v21.44,14.12 21.44,14.43 20.68,15.19 U3.1 | v12.6,10.62 11.53,11.68 C5.1
VREF+  (via drill 0.35)
  Top 0.152: v23.27,8.18 23.27,10.31 21.89,11.68 21.89,12.14 J2.7 | v6.5,10.01 8.33,10.01 U1.12
  Route15 0.152: v13.66,3.15 13.36,3.15 v6.5,10.01
  Bottom 0.152: v23.27,8.18 21.29,6.2 21.29,5.13 C9.1 21.13,4.98 20.07,3.91 18.69,3.91 17.78,3 13.82,3 v13.66,3.15 | U2.6 5.44,4.83 5.44,5.28 U2.7 5.59,5.44 6.2,5.44 6.5,5.74 6.5,6.35 5.13,7.72 5.13,10.01 | 5.13,10.01 5.13,15.49 C11.1 | 5.13,10.01 v6.5,10.01
VSS  (via drill 0.35)
  Top 0.152: 9.55,13.51 10.31,13.51 12.75,15.95 | 9.55,13.51 8.48,13.51 U1.5 | 12.75,15.95 12.9,16.1 12.9,16.87 U1.42 | 12.75,15.95 15.95,12.75 15.95,12.14 16.1,11.99 16.87,11.99 U1.29 | 9.55,13.51 9.55,16.1 6.04,19.61 6.04,20.22 C6.2 6.04,20.37 6.04,22.5 5.74,22.81 LED1.C 5.59,22.96 5.59,25.4 LED2.C 5.74,25.4 6.81,26.47 11.84,26.47 13.97,24.33 JP1.2 | 13.21,9.55 13.66,9.55 13.97,9.25 13.97,8.48 U1.21 13.97,8.33 13.97,6.35 11.23,3.61 | 13.21,9.55 11.84,9.55 11.53,9.25 11.53,8.48 U1.16 | 7.26,3.61 7.26,4.98 C1.2 | 7.26,3.61 7.26,2.54 C2.2 | 11.23,3.61 12.29,2.54 C3.2 | 7.26,3.61 11.23,3.61 | C7.2 30.28,3.91 30.28,5.13 33.63,8.48 33.63,12.14 31.8,13.97 JP2.3 | v25.7,3.76 25.4,3.45 24.94,3.45 J1.1 | 31.19,13.51 31.65,13.97 JP2.3 | 31.19,13.51 29.82,12.14 24.94,12.14 J2.1 | 31.19,13.51 24.94,19.76 J3.1 | 31.19,13.51 JP2.3 | v19.91,24.94 23.72,24.94 24.79,23.88 24.79,23.42 J3.2 | v13.21,9.86 13.21,9.55
  Bottom 0.152: U2.4 9.86,4.22 9.86,4.67 U2.3 9.86,4.83 10.46,4.83 10.62,4.98 12.9,4.98 C8.2 13.06,4.98 14.73,3.3 17.63,3.3 19.3,4.98 C9.2 19.46,5.13 19.46,6.5 22.05,9.09 22.05,10.01 AC1.3 22.2,10.16 22.5,10.46 22.5,10.62 22.66,10.77 23.57,10.77 24.18,10.16 AC1.1 24.18,10.01 26.31,7.87 28.6,7.87 30.12,6.35 | 17.63,15.19 17.93,15.19 U3.19 18.09,15.19 18.39,15.19 U3.20 | U3.13 17.48,12.75 17.48,13.21 U3.14 17.63,13.36 | U3.15 17.63,13.82 17.63,14.12 U3.16 17.63,14.28 17.63,14.58 U3.17 17.63,14.73 17.63,15.19 | 17.63,13.36 17.63,13.66 U3.15 | 17.63,15.19 U3.18 | C14.2 23.27,15.19 23.27,12.75 C15.2 23.11,12.75 20.68,12.75 U3.6 20.52,12.75 20.52,13.21 U3.5 20.37,13.36 17.63,13.36 | 5.89,17.32 5.13,17.32 C11.2 | 5.89,17.32 9.55,13.66 11.38,13.66 C5.2 11.53,13.66 13.97,13.66 | 13.97,13.66 17.48,13.66 U3.15 | 13.97,13.66 C10.2 | AC1.11 23.11,17.93 24.03,17.93 AC1.12 24.18,17.78 24.49,17.47 27.69,17.47 27.84,17.63 | 27.84,17.63 28.75,18.54 28.75,19 C12.2 | IC1.9 15.34,21.13 15.04,21.13 IC1.8 14.88,21.13 14.88,21.59 | 14.88,21.59 14.88,23.11 13.97,24.03 JP1.2 | 14.88,21.59 14.12,21.59 12.9,20.37 11.23,20.37 C4.2 11.07,20.37 10.01,21.44 8.48,21.44 5.89,18.85 5.89,17.32 | v19.91,24.94 19.91,25.09 20.52,25.71 23.27,25.71 23.72,25.25 23.72,24.64 J4.8 | 27.84,17.63 31.5,13.97 JP2.3 | 30.12,6.35 27.53,3.76 v25.7,3.76 | 30.12,6.35 C13.2
  pour Route2: 1.27,26.67 34.29,26.67 34.29,1.27 1.27,1.27

### Text on the board
Top: BMA490L-PIC32MK V1.4